# EAGLE design Pickini3 (EAGLE 5.11)
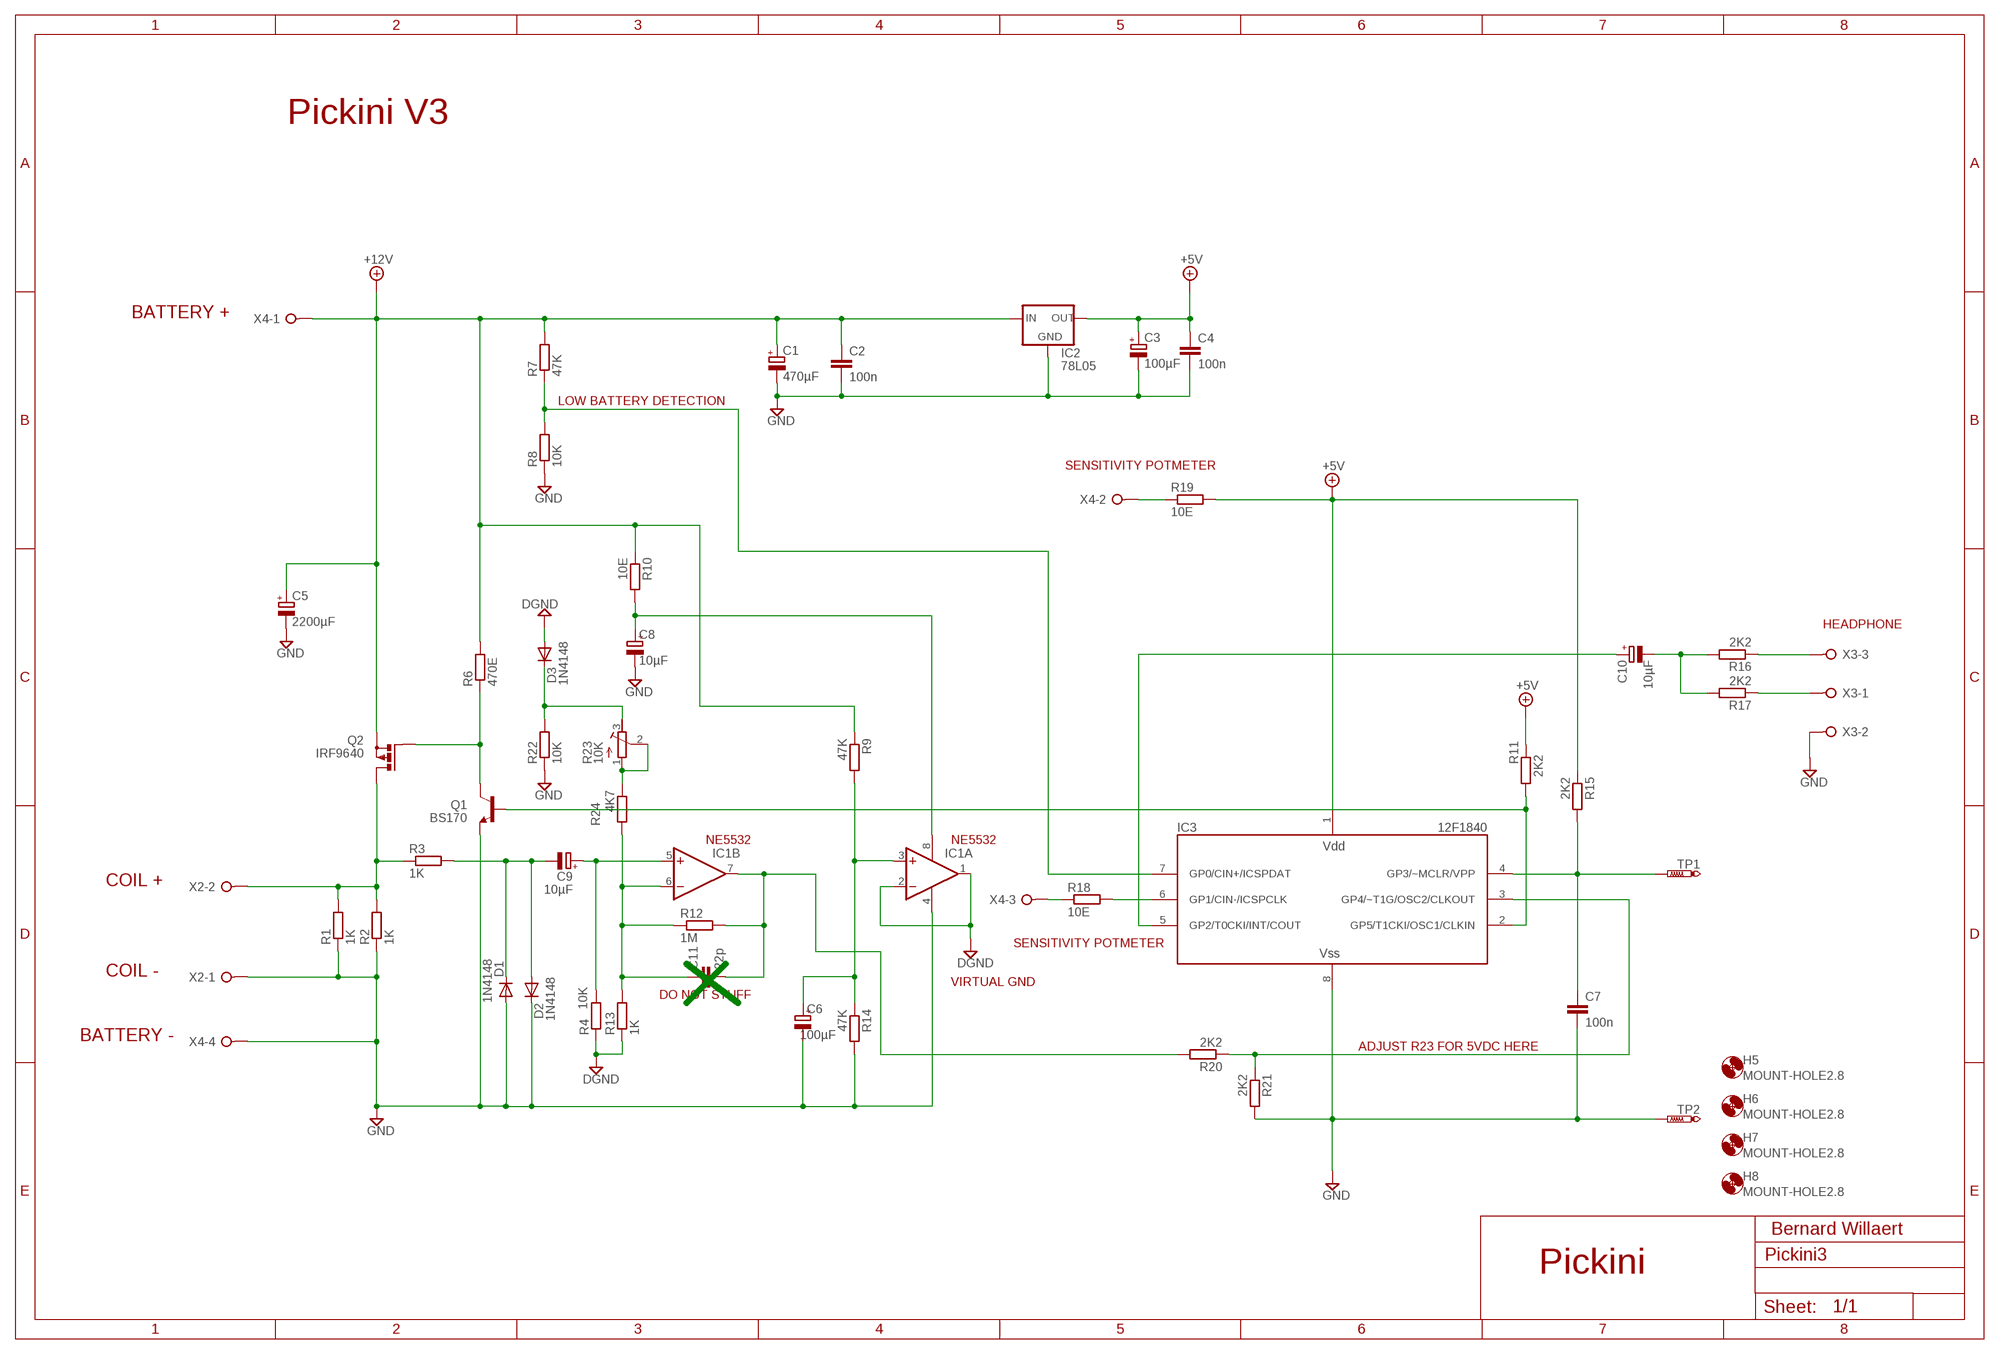
[diagram p0: schematic, sheet 1]

## Parts
C1  470µF  CPOL-EUE5-6  [E5-6]
C2  100n  C-EU050-025X075  [C050-025X075]
C3  100µF  CPOL-EUE5-6  [E5-6]
C4  100n  C-EU050-025X075  [C050-025X075]
C5  2200µF  CPOL-EUE7.5-16  [E7,5-16]
C6  100µF  CPOL-EUE5-6  [E5-6]
C7  100n  C-EU050-025X075  [C050-025X075]
C8  10µF  CPOL-EUE5-6  [E5-6]
C9  10µF  CPOL-EUE5-6  [E5-6]
C10  10µF  CPOL-EUE5-6  [E5-6]
C11  22p  C-EU050-025X075  [C050-025X075]
D1  1N4148  1N4148DO35-7  [DO35-7]
D2  1N4148  1N4148DO35-7  [DO35-7]
D3  1N4148  1N4148DO35-7  [DO35-7]
H5  MOUNT-HOLE2.8  [2,8]
H6  MOUNT-HOLE2.8  [2,8]
H7  MOUNT-HOLE2.8  [2,8]
H8  MOUNT-HOLE2.8  [2,8]
IC1  NE5532  LM358N  [DIL08]
IC2  78L05  78LXX  [78LXX]
IC3  12F1840  PIC12F629P  [DIP-8]
Q1  BS170  BC549-NPN-TO92-CBE  [TO92-CBE]
Q2  IRF9640  PMOSFET_PTO220BV  [TO220BV]
R1  1K  R-EU_0207/10  [0207/10]
R2  1K  R-EU_0207/10  [0207/10]
R3  1K  R-EU_0207/10  [0207/10]
R4  10K  R-EU_0207/10  [0207/10]
R6  470E  R-EU_0207/10  [0207/10]
R7  47K  R-EU_0207/10  [0207/10]
R8  10K  R-EU_0207/10  [0207/10]
R9  47K  R-EU_0207/10  [0207/10]
R10  10E  R-EU_0207/10  [0207/10]
R11  2K2  R-EU_0207/10  [0207/10]
R12  1M  R-EU_0207/10  [0207/10]
R13  1K  R-EU_0207/10  [0207/10]
R14  47K  R-EU_0207/10  [0207/10]
R15  2K2  R-EU_0207/10  [0207/10]
R16  2K2  R-EU_0207/10  [0207/10]
R17  2K2  R-EU_0207/10  [0207/10]
R18  10E  R-EU_0207/10  [0207/10]
R19  10E  R-EU_0207/10  [0207/10]
R20  2K2  R-EU_0207/10  [0207/10]
R21  2K2  R-EU_0207/10  [0207/10]
R22  10K  R-EU_0207/10  [0207/10]
R23  10K  R-TRIMM64W  [RTRIM64W]
R24  4K7  R-EU_0207/10  [0207/10]
TP1  PTR1PAD1-17  [P1-17]
TP2  PTR1PAD1-17  [P1-17]
X2  W237-02P  [W237-132]
X3  W237-3E  [W237-3E]
X4  W237-04P  [W237-4P]

## Nets
+5V: C3.+ C4.1 IC2.OUT IC3.1(VDD) R11.2 R15.1 R19.2
+12V: C1.+ C2.1 C5.+ IC2.IN Q2.S R6.2 R7.2 R9.1 R10.1 X4.1
DGND: D3.A IC1.1(A:OUT) IC1.2(A:-IN) R4.1 R13.1
GND: C1.- C2.2 C3.- C4.2 C5.- C6.- C7.2 C8.- D1.A D2.C IC1.4(P:V-) IC2.GND IC3.8(VSS) Q1.E R1.1 R2.1 R8.1 R14.2 R21.2 R22.1 TP2.TP X2.1 X3.2 X4.4
N$1: C7.1 IC3.4(GP3/~MCLR/VPP) R15.2 TP1.TP
N$2: C10.+ IC3.5(GP2/T0CKI/INT/COUT)
N$3: R18.1 X4.3
N$4: C9.- D1.C D2.A R3.2
N$5: IC3.2(GP5/T1CKI/OSC1/CLKIN) Q1.B R11.1
N$6: C10.- R16.2 R17.2
N$7: IC3.6(GP1/CIN-/ICSPCLK) R18.2
N$8: R16.1 X3.3
N$9: R17.1 X3.1
N$10: R19.1 X4.2
N$11: C8.+ IC1.8(P:V+) R10.2
N$12: IC3.7(GP0/CIN+/ICSPDAT) R7.1 R8.2
N$13: R23.1(E) R23.2(S) R24.1
N$14: C11.1 IC1.6(B:-IN) R12.1 R13.2 R24.2
N$15: C9.+ IC1.5(B:+IN) R4.2
N$17: IC3.3(GP4/~T1G/OSC2/CLKOUT) R20.1 R21.1
N$18: D3.C R22.2 R23.3(A)
N$19: C6.+ IC1.3(A:+IN) R9.2 R14.1
N$20: Q2.D R1.2 R2.2 R3.1 X2.2
N$23: Q1.C Q2.G R6.1
N$30: C11.2 IC1.7(B:OUT) R12.2 R20.2

## Notes on the sheet
- Pickini V3
- BATTERY +
- LOW BATTERY DETECTION
- SENSITIVITY POTMETER
- HEADPHONE
- NE5532 | NE5532
- COIL +
- SENSITIVITY POTMETER
- COIL - | VIRTUAL GND
- DO NOT STUFF
- BATTERY - | ADJUST R23 FOR 5VDC HERE
- Bernard Willaert
- Pickini

## Library data of the parts
C1 C3 C5 C6 C8-C10 = rcl:CPOL-EU: POLARIZED CAPACITOR, European symbol
C2 C4 C7 C11 = rcl:C-EU: CAPACITOR, European symbol
D1-D3 = diode:1N4148: DIODE high speed (Philips)
H5-H8 = holes:MOUNT-HOLE: MOUNTING HOLE with drill center marker
IC1 = linear:LM358: OP AMP also LM158; LM258; LM2904 Source: http://cache.national.com/ds/LM/LM158.pdf
IC2 = v-reg:78LXX: VOLTAGE REGULATOR
IC3 = microchip2:PIC12F629: Microchip PIC12F629 8-pin 8-bit Flash microcontroller 1024 words program memory, 64 bytes RAM, 128 bytes EEPROM 6 I/O, 1 comparator, 1 8-bit timer, 1 16-bit timer
Q1 = transistor:*-NPN-: NPN Transistror BF959 corrected 2008.03.06
Q2 = transistor-power:PMOSFET_P: Power MOSFET P-Channel
R1-R4 R6-R22 R24 = rcl:R-EU_: RESISTOR, European symbol
R23 = rcl:R-TRIMM: Trimm resistor
TP1 TP2 = testpad:PTR1: TEST PIN
X2 = con-wago-508:W237-02P: WAGO SREW CLAMP; OC_FARNELL: unknown; OC_NEWARK: unknown
X3 = con-wago-508:W237-3E: WAGO SREW CLAMP; OC_FARNELL: unknown; OC_NEWARK: unknown
X4 = con-wago-508:W237-04P: WAGO SREW CLAMP; OC_FARNELL: unknown; OC_NEWARK: unknown

## Board
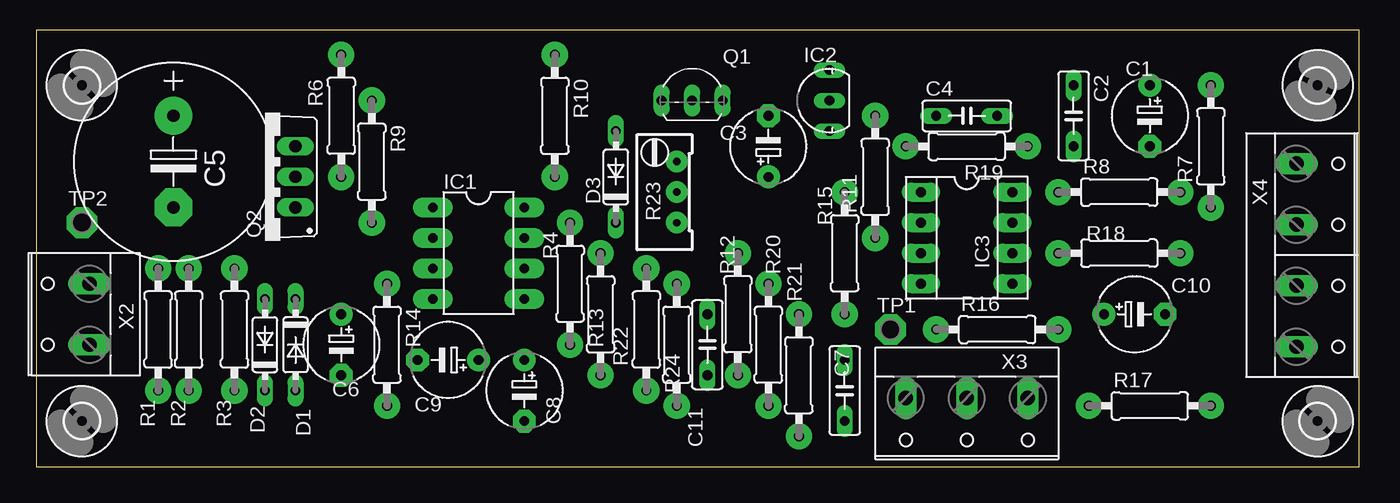
[diagram p1: board, top side]
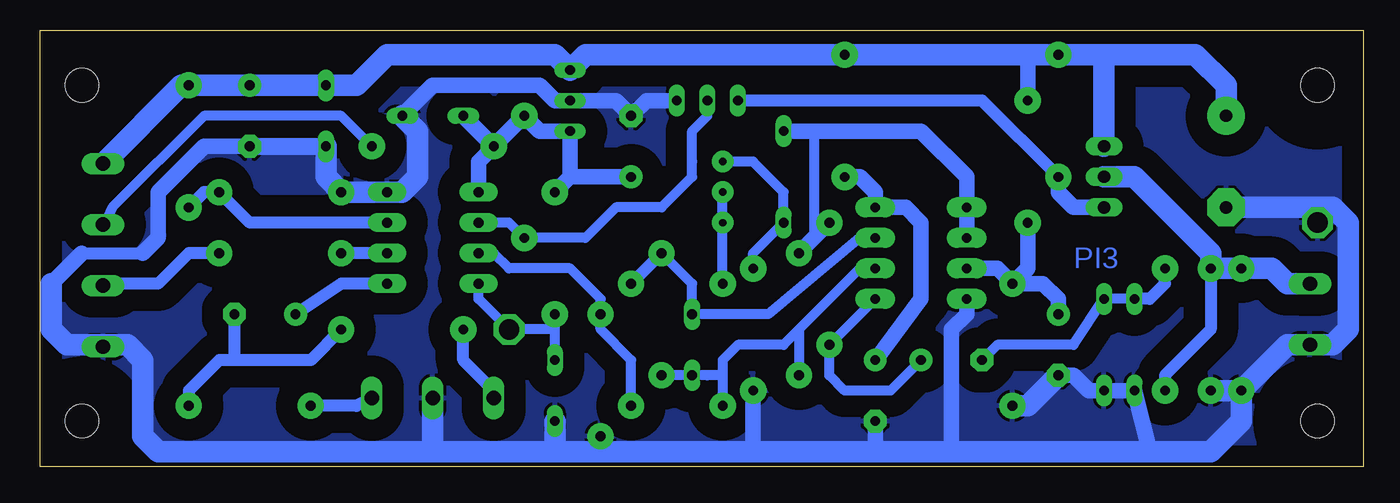
[diagram p2: board, bottom side, seen from below]

Size 110.16 x 36.35 mm. Coordinates in mm from the lower left corner, seen from the top.
Outline: 0,0 110.16,0 110.16,36.35 0,36.35 0,0
Copper layers (1*16): Top 0.035mm / dielectric 1.5mm / Bottom 0.035mm
Design rules "default": minimum track width 10mil, minimum drill 24mil, track to track 8mil, track to pad 8mil, pad to pad 8mil, via to via 8mil, smd to smd 8mil, copper to edge 40mil, drill to drill 8mil, minimum pad ring 10mil, minimum via ring 8mil, stop-mask expansion 4mil, vias tented up to drill 0mil, thermal gap 10mil

### Footprints (pad centres in the part's own frame; a part is rotated, then mirrored left to right if it is on the bottom)
E5-6 = drill 0.813 pad 1.905 round: + -2.54,0 | drill 0.813 pad 1.905 octagon: - 2.54,0
C050-025X075 = drill 0.813 long: 1 -2.54,0; 2 2.54,0
E7,5-16 = drill 1.016 pad 3.15 round: + -3.81,0 | drill 1.016 pad 3.15 octagon: - 3.81,0
DO35-7 = drill 0.813 long: A 3.81,0; C -3.81,0
2,8 = hole 2.8: 0,0
DIL08 = drill 0.813 pad 1.676 long: 1 -3.81,-3.81; 2 -1.27,-3.81; 3 1.27,-3.81; 4 3.81,-3.81; 5 3.81,3.81; 6 1.27,3.81; 7 -1.27,3.81; 8 -3.81,3.81
78LXX = drill 0.8 pad 1.27 long: GND 0,0; IN 2.54,0; OUT -2.54,0
DIP-8 = drill 0.813 pad 1.6 long: 1 -3.81,3.81; 2 -3.81,1.27; 3 -3.81,-1.27; 4 -3.81,-3.81; 5 3.81,-3.81; 6 3.81,-1.27; 7 3.81,1.27; 8 3.81,3.81
TO92-CBE = drill 0.813 long: B 0,0; C -2.54,0; E 2.54,0
TO220BV = drill 1.016 long: D 0,-2.54; G -2.54,-2.54; S 2.54,-2.54
0207/10 = drill 0.813 pad 2.184 round: 1 -5.08,0; 2 5.08,0
RTRIM64W = drill 0.61 pad 1.778 round: 1 1.27,-2.54; 2 1.27,0; 3 1.27,2.54
P1-17 = drill 1.702 pad 2.54 octagon: TP 0,0
W237-132 = drill 1.194 long: 1 -2.54,-0.635; 2 2.54,-0.635
W237-3E = drill 1.194 long: 1 -5.08,-0.635; 2 0,-0.635; 3 5.08,-0.635
W237-4P = drill 1.194 long: 1 -7.62,-0.635; 2 -2.54,-0.635; 3 2.54,-0.635; 4 7.62,-0.635

### Placement (x,y rotation side)
C1  92.71,29.21 270 top
C2  86.36,29.21 270 top
C3  60.96,26.67 90 top
C4  77.47,29.21 0 top
C5  11.43,25.4 270 top
C6  25.4,10.16 270 top
C7  67.31,6.35 270 top
C8  40.64,6.35 270 top
C9  34.29,8.89 180 top
C10  91.44,12.7 0 top
C11  55.88,10.16 90 top
D1  21.59,10.16 270 top
D2  19.05,10.16 90 top
D3  48.26,24.13 90 top
H5  106.68,3.81 0 top
H6  3.81,3.81 0 top
H7  3.81,31.75 0 top
H8  106.68,31.75 19.7 top
IC1  36.83,17.78 270 top
IC2  66.04,30.48 90 top
IC3  77.47,19.05 0 top
Q1  54.61,30.48 0 top
Q2  19.05,24.13 90 top
R1  10.16,11.43 90 top
R2  12.7,11.43 90 top
R3  16.51,11.43 90 top
R4  44.45,15.24 270 top
R6  25.4,29.21 90 top
R7  97.79,26.67 90 top
R8  90.17,22.86 0 top
R9  27.94,25.4 270 top
R10  43.18,29.21 270 top
R11  69.85,24.13 90 top
R12  58.42,12.7 90 top
R13  46.99,12.7 270 top
R14  29.21,10.16 270 top
R15  67.31,17.78 270 top
R16  80.01,11.43 0 top
R17  92.71,5.08 0 top
R18  90.17,17.78 180 top
R19  77.47,26.67 180 top
R20  60.96,10.16 90 top
R21  63.5,7.62 270 top
R22  50.8,11.43 90 top
R23  52.07,22.86 0 top
R24  53.34,10.16 270 top
TP1  71.12,11.43 0 top
TP2  3.81,20.32 0 top
X2  3.81,12.7 90 top
X3  77.47,5.08 180 top
X4  105.55,17.62 270 top

### Tracks (layer width: path | path; a pad name or v marks a point on that pad's centre or on a via)
+5V
  Bottom 1.27: R19.2 C4.1 | R19.2 73.66,25.4 IC3.1 | R19.2 R11.2 68.58,27.94 IC2.OUT 66.04,24.13 | C3.+ 66.04,24.13 | 66.04,24.13 R15.1
+12V
  Bottom 1.27: 27.94,34.29 R9.1
  Bottom 1.778: 21.59,34.29 R6.2 27.94,34.29 R10.1 64.77,34.29 IC2.IN 67.31,34.29 81.28,34.29 83.82,31.75 C2.1 C1.+ R7.2 98.41,31.75 X4.1 | Q2.S 21.59,34.29 | 21.59,34.29 13.97,34.29 11.43,31.75 C5.+
DGND
  Bottom 0.813: 45.72,27.94 45.72,19.05
  Bottom 1.27: IC1.2 IC1.1 33.02,24.13 36.83,27.94 45.72,27.94 D3.A | R13.1 45.72,19.05 R4.1
GND
  Bottom 0.406: X4.4 105.08,10.16
  Bottom 1.016: 106.68,17.78 101.6,17.78
  Bottom 1.27: C1.- 96.52,26.67 100.33,22.86 100.33,19.05 101.6,17.78 | 109.22,15.24 106.68,17.78 | C4.2 77.47,31.75 68.58,31.75 67.31,30.48 IC2.GND 62.23,30.48 C3.- 59.69,30.48 Q1.E | C6.- 24.13,7.62 22.86,6.35 D1.A D2.C 17.78,1.27 | 34.29,1.27 34.29,11.43 33.02,12.7 IC1.4 | 40.64,1.27 C8.- | 50.8,1.27 R22.1 | 63.5,1.27 R21.2
  Bottom 1.422: C1.- C2.2
  Bottom 1.778: 67.31,1.27 63.5,1.27 50.8,1.27 40.64,1.27 34.29,1.27 17.78,1.27 12.7,1.27 10.16,3.81 R1.1 | 67.31,1.27 77.47,1.27 | 77.47,1.27 X3.2 | 109.22,15.24 109.22,11.43 107.95,10.16 105.08,10.16 | X4.4 104.75,10.16 102.87,10.16 101.6,8.89 101.6,2.54 100.33,1.27 77.47,1.27 | 67.31,1.27 C7.2 | R1.1 6.35,10.16 X2.1 2.54,10.16 1.27,11.43 1.27,20.32 2.54,21.59 | 2.54,21.59 C5.- | R1.1 R2.1 | C4.2 78.74,27.94 78.74,24.13 80.01,22.86 IC3.8 R8.1 86.36,24.13 C2.2 | 2.54,21.59 TP2.TP | C6.- 27.94,5.08 R14.2
  pour Bottom (isolate 1.778): 1.27,35.56 1.27,1.27 109.22,1.27 109.22,35.56
N$1
  Bottom 0.813: C7.1 67.31,11.43 | 67.31,11.43 R15.2 | IC3.4 73.66,13.97 TP1.TP 67.31,11.43
N$2
  Bottom 1.016: IC3.5 85.09,15.24 C10.+
N$3
  Bottom 0.406: 104.75,15.24 X4.3
  Bottom 1.016: R18.1 97.79,17.78 100.33,15.24 104.75,15.24
N$4
  Bottom 0.813: D2.A D1.C 24.13,10.16 30.48,10.16 C9.-
  Bottom 1.016: R3.2 16.51,15.24 17.78,13.97 D2.A
N$5
  Bottom 0.813: IC3.2 71.12,20.32 R11.1 64.77,19.05 62.23,21.59 58.42,21.59 55.88,24.13 55.88,25.4 55.88,27.94 54.61,29.21 Q1.B
N$6
  Bottom 1.016: R16.2 87.63,8.89 93.98,8.89 | 93.98,8.89 95.25,8.89 97.79,6.35 R17.2 | 93.98,8.89 C10.-
N$7
  Bottom 1.016: IC3.6 R18.2
N$8
  Bottom 1.016: X3.3 72.39,6.35 74.93,8.89 R16.1
N$9
  Bottom 1.016: X3.1 83.82,5.08 R17.1
N$10
  Bottom 0.406: 104.75,20.32 X4.2
  Bottom 0.813: R19.1 85.09,29.21 96.52,29.21 104.14,21.59 104.75,20.32
N$11
  Bottom 1.27: C8.+ 36.83,13.97 36.83,20.32 38.1,21.59 IC1.8 40.64,22.86 41.91,24.13 R10.2
N$12
  Bottom 1.016: IC3.7 92.71,20.32 R8.2 96.52,22.86 R7.1
N$13
  Bottom 0.813: R24.1 R23.1 R23.2
N$14
  Bottom 0.813: IC1.6 41.91,16.51 46.99,11.43 | R12.1 C11.1 54.61,7.62 53.34,7.62 | 46.99,11.43 48.26,10.16 52.07,10.16 53.34,8.89 53.34,7.62 | 53.34,7.62 R24.2 | 46.99,11.43 R13.2
N$15
  Bottom 0.813: C9.+ 39.37,6.35 43.18,6.35 44.45,7.62 R4.2 IC1.5
N$17
  Bottom 0.813: R20.1 60.96,8.89 63.5,11.43 R21.1 63.5,13.97 66.04,16.51 71.12,16.51 72.39,17.78 IC3.3
N$18
  Bottom 0.813: R22.2 50.8,17.78 D3.C 48.26,22.86 50.8,25.4 R23.3
N$19
  Bottom 1.27: R14.1 30.48,16.51 IC1.3 | C6.+ 25.4,13.97 26.67,15.24 R14.1 | R14.1 27.94,16.51 R9.2
N$20
  Bottom 1.016: R2.2 12.7,11.43 16.51,7.62 R3.1
  Bottom 1.778: X2.2 6.35,15.24 7.62,16.51 R1.2 R2.2 12.7,17.78 19.05,24.13 Q2.D
N$23
  Bottom 1.016: Q1.C 31.75,30.48 R6.1
  Bottom 1.27: R6.1 25.4,22.86 24.13,21.59 Q2.G
N$30
  Bottom 0.813: IC1.7 41.91,19.05 49.53,12.7 C11.2 55.88,15.24 R12.2
  Bottom 1.016: R12.2 R20.2

### Text on the board
Bottom: PI3